# Altium schematic sheet CATS-Vega-Overview.SchDoc: CATS Vega
size A4; DocumentNumber: Overview; Revision: V1.0; SheetNumber: 1; SheetTotal: 16; Author: Luca Jost; Subtitle: Overview
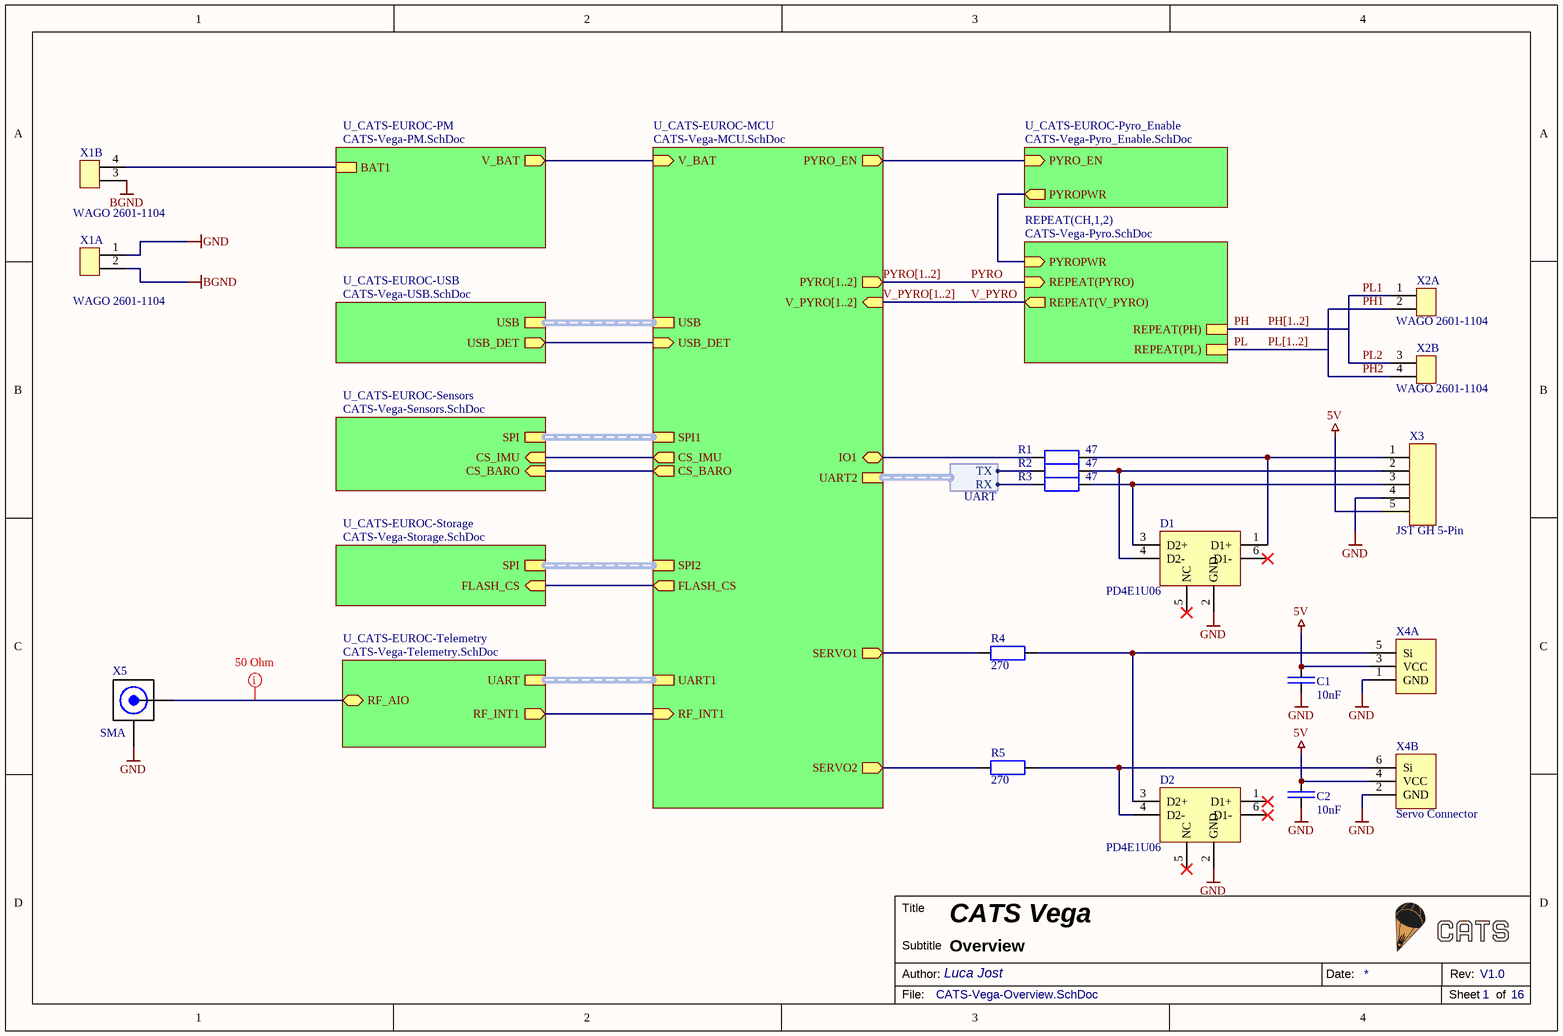
[diagram p0: CATS-Vega-Overview.SchDoc]

## Parts
C1  10nF  [SMD Keramikkondensator 0603]
C2  10nF  [SMD Keramikkondensator 0603]
D1  PD4E1U06  [SMD IC SOT-363 (SC-70-6)]
D2  PD4E1U06  [SMD IC SOT-363 (SC-70-6)]
R1  47  [SMD Widerstand 0603]
R2  47  [SMD Widerstand 0603]
R3  47  [SMD Widerstand 0603]
R4  270  [SMD Widerstand 0603]
R5  270  [SMD Widerstand 0603]
X1  WAGO 2601-1104  [THT PCB Terminal WAGO 2601-1104]  (parts A,B of 2)
X2  WAGO 2601-1104  [THT PCB Terminal WAGO 2601-1104]  (parts A,B of 2)
X3  JST GH 5-Pin  [SMD Connector JST GH-5]
X4  Servo Connector  [THT Stiftleiste 6-Pol (2x3) 90°]  (value not drawn)  (parts A,B of 2)
X5  SMA  [THT Buchse SMA Female]

## Sub-sheets
REPEAT(CH,1,2) = CATS-Vega-Pyro.SchDoc: REPEAT(V_PYRO) (out), REPEAT(PYRO) (in), REPEAT(PH), REPEAT(PL), PYROPWR (in)
U_CATS-EUROC-MCU = CATS-Vega-MCU.SchDoc: SPI1 (harness SPI), UART1 (harness UART), USB (harness USB), V_PYRO[1..2] (in), PYRO[1..2] (out), IO1 (bidir), SERVO1 (out), SERVO2 (out), USB_DET (in), V_BAT (in), CS_IMU (out), CS_BARO (out), RF_INT1 (in), PYRO_EN (out), SPI2 (harness SPI), FLASH_CS (out), UART2 (harness UART)
U_CATS-EUROC-PM = CATS-Vega-PM.SchDoc: V_BAT (out), BAT1
U_CATS-EUROC-Pyro_Enable = CATS-Vega-Pyro_Enable.SchDoc: PYRO_EN (in), PYROPWR (out)
U_CATS-EUROC-Sensors = CATS-Vega-Sensors.SchDoc: CS_IMU (in), SPI, CS_BARO (in)
U_CATS-EUROC-Storage = CATS-Vega-Storage.SchDoc: SPI (harness SPI), FLASH_CS (in)
U_CATS-EUROC-Telemetry = CATS-Vega-Telemetry.SchDoc: UART, RF_INT1 (out), RF_AIO (bidir)
U_CATS-EUROC-USB = CATS-Vega-USB.SchDoc: USB (harness USB), USB_DET (out)

## Harnesses
UART: TX, RX

## Nets
5V: C1.2 C2.2 X3.5 X4.3(VCC) X4.4(VCC)
BGND: X1.2 X1.3
GND: C1.1 C2.1 D1.2(GND) D2.2(GND) X1.1 X3.4 X4.1(GND) X4.2(GND) X5.2(RF)
PH: sheet REPEAT(CH,1,2)/REPEAT(PH)
PH1: X2.2
PH2: X2.4
PL: sheet REPEAT(CH,1,2)/REPEAT(PL)
PL1: X2.1
PL2: X2.3
PYRO: sheet REPEAT(CH,1,2)/REPEAT(PYRO)
V_PYRO: sheet REPEAT(CH,1,2)/REPEAT(V_PYRO)
NetD1_1: D1.1(D1+) R1.2 X3.1
NetD1_3: D1.3(D2+) R3.2 X3.3
NetD1_4: D1.4(D2-) R2.2 X3.2
NetD2_3: D2.3(D2+) R4.2 X4.5(Si)
NetD2_4: D2.4(D2-) R5.2 X4.6(Si)
NetR1_1: R1.1 ; sheet U_CATS-EUROC-MCU/IO1
NetR2_1: R2.1 ; sheet U_CATS-EUROC-MCU/UART2.TX
NetR3_1: R3.1 ; sheet U_CATS-EUROC-MCU/UART2.RX
NetR4_1: R4.1 ; sheet U_CATS-EUROC-MCU/SERVO1
NetR5_1: R5.1 ; sheet U_CATS-EUROC-MCU/SERVO2
NetX1_4: X1.4 ; sheet U_CATS-EUROC-PM/BAT1
NetX5_1: X5.1(RF) ; sheet U_CATS-EUROC-Telemetry/RF_AIO
(unnamed): sheet U_CATS-EUROC-Sensors/CS_IMU, sheet U_CATS-EUROC-MCU/CS_IMU
(unnamed): sheet U_CATS-EUROC-Sensors/CS_BARO, sheet U_CATS-EUROC-MCU/CS_BARO
(unnamed): sheet U_CATS-EUROC-MCU/USB_DET, sheet U_CATS-EUROC-USB/USB_DET
(unnamed): sheet U_CATS-EUROC-MCU/V_BAT, sheet U_CATS-EUROC-PM/V_BAT
(unnamed): sheet U_CATS-EUROC-MCU/RF_INT1, sheet U_CATS-EUROC-Telemetry/RF_INT1
(unnamed): sheet U_CATS-EUROC-MCU/PYRO_EN, sheet U_CATS-EUROC-Pyro_Enable/PYRO_EN
(unnamed): sheet U_CATS-EUROC-MCU/FLASH_CS, sheet U_CATS-EUROC-Storage/FLASH_CS
(unnamed): sheet REPEAT(CH,1,2)/PYROPWR, sheet U_CATS-EUROC-Pyro_Enable/PYROPWR

Not connected (* = marked no-connect by the designer): D1 5(NC)* 6(D1-)*; D2 1(D1+)* 5(NC)* 6(D1-)*

## Buses and harness runs
bus PH[1..2]
bus PL[1..2]
bus PYRO[1..2] = sheet U_CATS-EUROC-MCU/PYRO[1..2]
bus V_PYRO[1..2] = sheet U_CATS-EUROC-MCU/V_PYRO[1..2]
harness sheet U_CATS-EUROC-MCU/SPI1 = sheet U_CATS-EUROC-Sensors/SPI
harness sheet U_CATS-EUROC-MCU/SPI2 = sheet U_CATS-EUROC-Storage/SPI
harness sheet U_CATS-EUROC-MCU/UART1 = sheet U_CATS-EUROC-Telemetry/UART
harness sheet U_CATS-EUROC-MCU/USB = sheet U_CATS-EUROC-USB/USB

## Layout directives
rule Impedance Constraint [Min = 50.00    Max = 50.00    ]; net class RF-Line 50: NetX5_1

## Notes on the sheet
- Title
- Author:
- Subtitle
- Date:
- Rev:
- File:
- Sheet
- of

## Library data of the parts
C1 C2 = E6 - 10nF: SMD Ceramic Capacitor E6; Unit Price: 0.0015; JLC: C1589
D1 D2 = PD4E1U06DCKR: Unidirectional 3A (8/20us) 15V (Typ) 6.5V 5.5V (Max) SOT-363 ESD Protection Devices ROHS; ComponentLink1Description: Datasheet; ComponentLink1URL: https://datasheet.lcsc.com/lcsc/1810172210_Texas-Instruments-TPD4E1U06DCKR_C194628.pdf; Digikey: 296-39347-1-ND; Farnell: 3116516; JLC: C194628; Mouser: 595-TPD4E1U06DCKR; Unit Price: 0.0382
R1-R3 = E24 - 47: SMD Chip Resistor E24; Unit Price: 0.001; JLC: C1211
R4 R5 = E24 - 270: SMD Chip Resistor E24; Unit Price: 0.001; JLC: C22966
X1 X2 = WAGO 2601-1104: PCB terminal blocks with levers and Push-in CAGE CLAMP® connection; ComponentLink1Description: Datasheet; ComponentLink1URL: https://www.wago.com/us/pcb-interconnect/pcb-terminal-block/p/2604-1106
X3 = JST GH 5-Pin: Connector Header Surface Mount, Right Angle 4 position 0.049" (1.25mm); ComponentLink1Description: Datasheet; ComponentLink1URL: https://www.jst-mfg.com/product/pdf/eng/eGH.pdf; JLC: C189896; Unit Price: 0.1871
X4 = Servo Connector Dual: 6 Pin header for PWM servos; JLC: C239334; Unit Price: 0.0962
X5 = SMA Connector: Female SMA Connector THT; Digikey: 931-1361-ND; JLC: C1509230; Unit Price: 0.4926